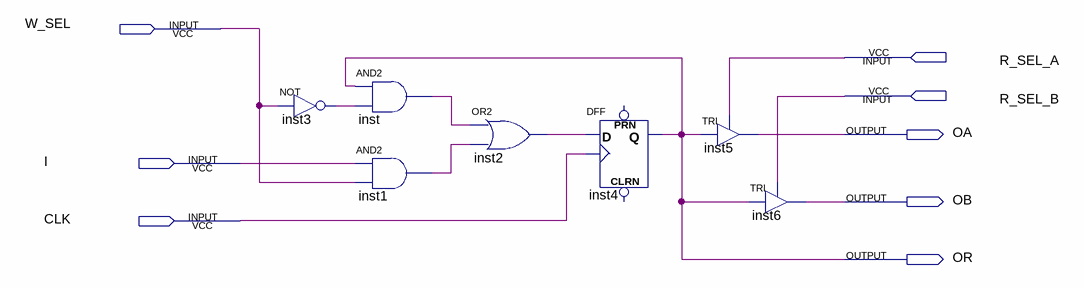
[diagram p0: schematic sheet]
// Quartus schematic RFC_2O.bdf as structural Verilog: 7 symbols, 8 pins
module RFC_2O (
  input  W_SEL,
  input  R_SEL_A,
  input  R_SEL_B,
  input  I,
  input  CLK,
  output OA,
  output OB,
  output OR
);

  wire inst1_out, inst2_out, inst3_out, inst_out;

  not inst3 (inst3_out, W_SEL);
  and inst (inst_out, OR, inst3_out);
  and inst1 (inst1_out, I, W_SEL);
  or inst2 (inst2_out, inst_out, inst1_out);
  DFF inst4 (.CLK(CLK), .D(inst2_out), .Q(OR));  // open: CLRN, PRN
  TRI inst5 (.IN(OR), .OE(R_SEL_A), .OUT(OA));
  TRI inst6 (.IN(OR), .OE(R_SEL_B), .OUT(OB));
endmodule
